# Altium schematic sheet CC_pwr-moteur.SchDoc
size A4; Author: Audran; CompanyName: Goldorak; Address1: Electrolab; Address2: 52 rue Paul Lescop; Address3: 92000 Nanterre; ProjectName: Cartes_2017
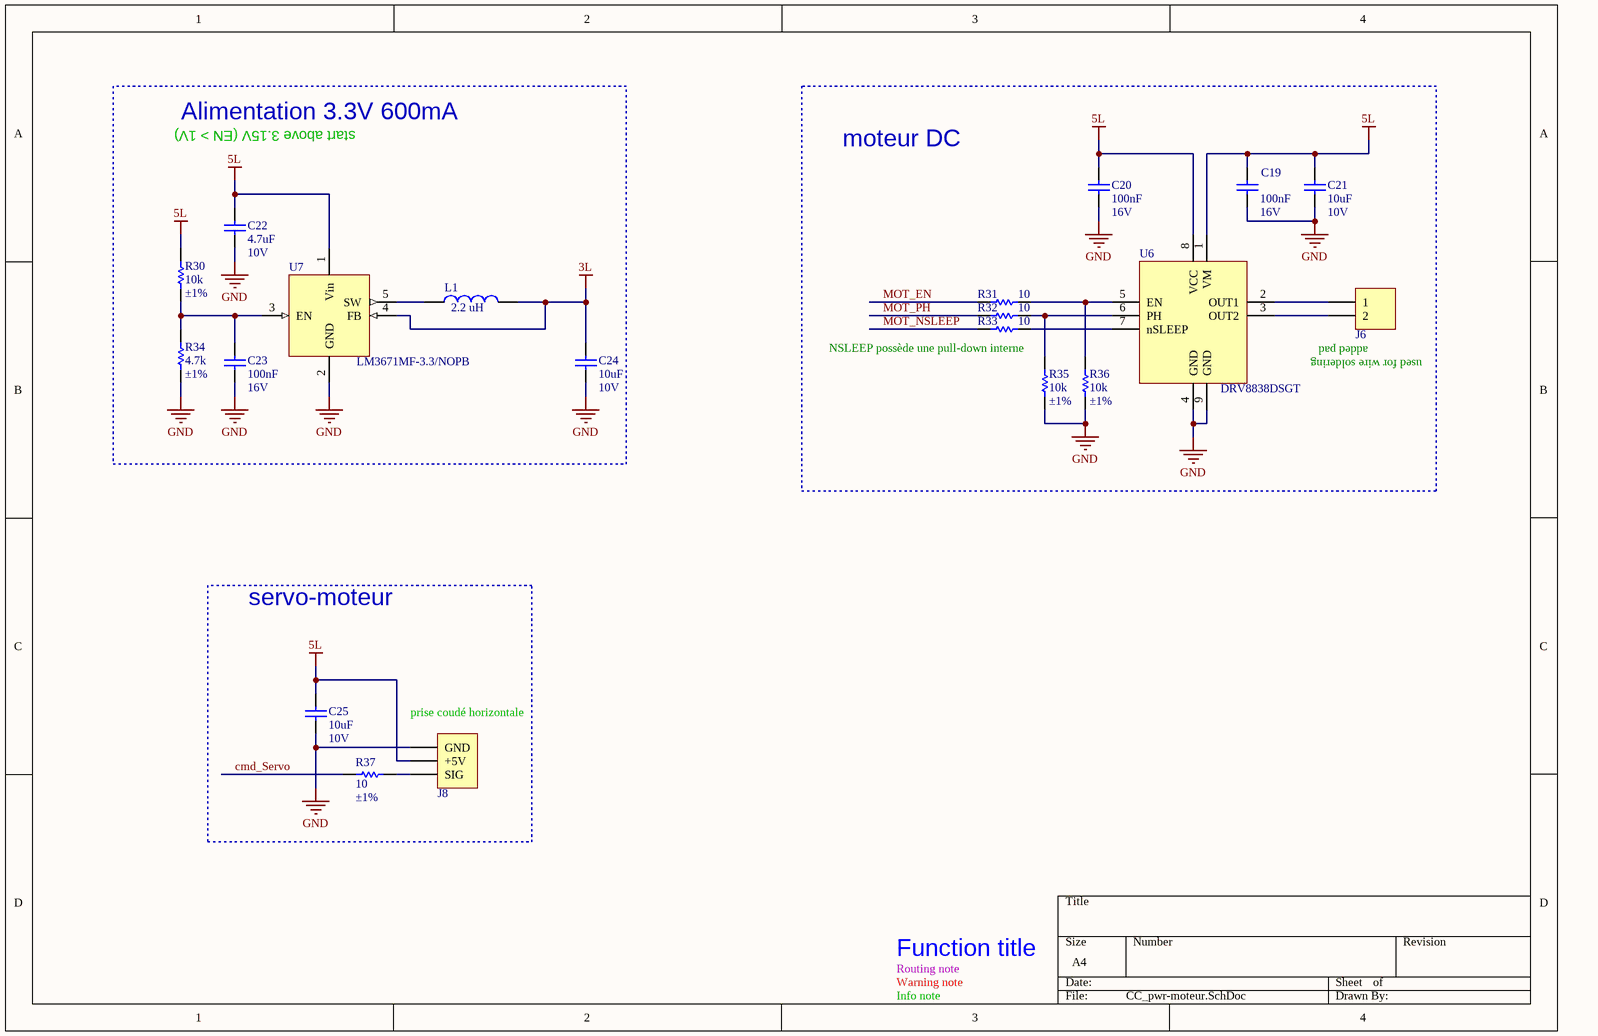
[diagram p0: CC_pwr-moteur.SchDoc]

## Parts
C19  100nF  RatedVoltage: 16V  [WCAP-CSGP_0402, 1x0.5x0.5]
C20  100nF  RatedVoltage: 16V  [WCAP-CSGP_0402, 1x0.5x0.5]
C21  10uF  RatedVoltage: 10V  [WCAP-CSGP_0805, 2x1.25x1.25]
C22  4.7uF  RatedVoltage: 10V  [WCAP-CSGP_0603, 1.6x0.8x0.8]
C23  100nF  RatedVoltage: 16V  [WCAP-CSGP_0402, 1x0.5x0.5]
C24  10uF  RatedVoltage: 10V  [WCAP-CSGP_0805, 2x1.25x1.25]
C25  10uF  RatedVoltage: 10V  [WCAP-CSGP_0805, 2x1.25x1.25]
J6  653102131822  [653102131822]  (value not drawn)
J8  61300311021  [61300311021]  (value not drawn)
L1  value 2.2 uH  [WE-LQS_2010]  (hidden comment: 74404020022)
R30  value 10k  Precision: ±1%  [RESC1005X04N]  (hidden comment: RC0402FR-0710KL)
R31  value 10  [RESC1005X04N]  (hidden comment: RC0402FR-0710RL)
R32  value 10  [RESC1005X04N]  (hidden comment: RC0402FR-0710RL)
R33  value 10  [RESC1005X04N]  (hidden comment: RC0402FR-0710RL)
R34  value 4.7k  Precision: ±1%  [RESC1005X04N]
R35  value 10k  Precision: ±1%  [RESC1005X04N]  (hidden comment: RC0402FR-0710KL)
R36  value 10k  Precision: ±1%  [RESC1005X04N]  (hidden comment: RC0402FR-0710KL)
R37  value 10  Precision: ±1%  [RESC1005X04N]  (hidden comment: RC0402FR-0710RL)
U6  DRV8838DSGT  [PSON50P200X80_HS-9N]
U7  LM3671MF-3.3/NOPB  [SOT23-5]

## Blocks framed on the sheet
Alimentation 3.3V 600mA: C22-C24 L1 R30 R34 U7
moteur DC: C19-C21 J6 R31-R33 R35 R36 U6
servo-moteur: C25 J8 R37

## Nets
3L: C24.2 L1.2 U7.4(FB)
5L: C19.2 C20.2 C21.2 C22.2 C25.2 J8.2(+5V) R30.2 U6.1(VM) U6.8(VCC) U7.1(Vin)
GND: C19.1 C20.1 C21.1 C22.1 C23.1 C24.1 C25.1 J8.1(GND) R34.1 R35.1 R36.1 U6.4(GND) U6.9(GND) U7.2(GND)
cmd_Servo: R37.1
MOT_EN: R31.1
MOT_NSLEEP: R33.1
MOT_PH: R32.1
NetC23_2: C23.2 R30.1 R34.2 U7.3(EN)
NetJ6_1: J6.1 U6.2(OUT1)
NetJ6_2: J6.2 U6.3(OUT2)
NetJ8_3: J8.3(SIG) R37.2
NetL1_1: L1.1 U7.5(SW)
NetR31_2: R31.2 R36.2 U6.5(EN)
NetR32_2: R32.2 R35.2 U6.6(PH)
NetR33_2: R33.2 U6.7(nSLEEP)

## Notes on the sheet
- start above 3.15V (EN > 1V)
- NSLEEP possède une pull-down interne
- (near J6) added pad
- used for wire soldering
- (near J8) prise coudé horizontale
- Routing note
- Warning note
- Function title
- Info note

## Library data of the parts
C19 C20 C23 = WCAP-CSGP, 885012205037: CAP CER 100nF 16V X7R 0402; Manufacturer: Wurth Elektronik; PublishedDate: Aug 2016; ComponentLink1Description: Manufacturer; ComponentLink1URL: http://www.we-online.de; ComponentLink2Description: Datasheet; ComponentLink2URL: http://katalog.we-online.com/pbs/datasheet/885012205037.pdf; Manufacturer Part Number: 885012205037; Value: 100nF; Size: 0402; CeramicType: X7R
C21 C24 C25 = WCAP-CSGP, 885012207026: CAP CER 10uF 10V X7R 0805; Manufacturer: Wurth Elektronik; PublishedDate: Aug 2016; ComponentLink1Description: Manufacturer; ComponentLink1URL: http://www.we-online.de; ComponentLink2Description: Datasheet; ComponentLink2URL: http://katalog.we-online.com/pbs/datasheet/885012207026.pdf; Manufacturer Part Number: 885012207026; Value: 10uF; Size: 0805; CeramicType: X7R
C22 = WCAP-CSGP, 885012106012: CAP CER 4.7UF 10V X5R 0603; Manufacturer: Wurth Elektronik; PublishedDate: Aug 2016; ComponentLink1Description: Manufacturer; ComponentLink1URL: http://www.we-online.de; ComponentLink2Description: Datasheet; ComponentLink2URL: http://katalog.we-online.com/pbs/datasheet/885012106012.pdf; Manufacturer Part Number: 885012106012; Value: 4.7uF; Size: 0603; CeramicType: X5R
J6 = 653102131822: WR-WTB 2 horiz. 1.25mm; Manufacturer: Wurth Electronics Inc.; Value: 2; ComponentLink1URL: http://www.we-online.com; ComponentLink2URL: http://katalog.we-online.de/em/datasheet/6531xx131822.pdf; Manufacturer Part Number: 653102131822; Supplier 1: farnell; Supplier Part Number 1: 1841413; ComponentLink1Description: Manufacturer; ComponentLink2Description: Datasheet
J8 = 61300311021: CONN HEADER 3p horiz. 2.54mm; Manufacturer: Wurth Electronics Inc.; Value: 3; Supplier 1: Farnell; Supplier Part Number 1: 2356177; Manufacturer Part Number: 61300311021; ComponentLink1URL: http://www.we-online.com; ComponentLink1Description: Manufacturer; ComponentLink2Description: Datasheet; ComponentLink2URL: http://katalog.we-online.de/em/datasheet/6130xx11021.pdf
L1 = 74404020022: FIXED IND 2.2UH 960MA 220 MOHM; Manufacturer: Wurth Elektronik; RatedCurrent: 0.96 A; PublishedDate: Nov. 2016; ComponentLink1Description: Manufacturer; ComponentLink1URL: http://www.we-online.de; ComponentLink2Description: Datasheet; ComponentLink2URL: http://katalog.we-online.de/pbs/datasheet/74404020022.pdf; Manufacturer Part Number: 74404020022; Size: 2010
R30 R35 R36 = RC0402FR-0710KL: RES SMD 10K OHM 1% 1/16W 0402; Manufacturer: Yageo; Power: 63mW; Vmax: 50V; Type: Thick Film; ComponentLink1Description: Manufacturer; ComponentLink1URL: http://www.yageo.com/NewPortal/_en/index.jsp; ComponentLink2Description: Datasheet; ComponentLink2URL: http://www.farnell.com/datasheets/2167052.pdf; Supplier 1: Farnell; Supplier Part Number 1: 9239359; Manufacturer Part Number: RC0402FR-0710KL
R31-R33 R37 = RC0402FR-0710RL: RES SMD 10 OHM 1% 1/16W 0402; Manufacturer: Yageo; Power: 63mW; Vmax: 50V; Type: Thick Film; ComponentLink1Description: Manufacturer; ComponentLink1URL: http://www.yageo.com/NewPortal/_en/index.jsp; ComponentLink2Description: Datasheet; ComponentLink2URL: http://www.farnell.com/datasheets/1018594.pdf; Manufacturer Part Number: RC0402FR-0710RL; Supplier 1: Farnell; Supplier Part Number 1: 9238999
  R31-R33: Precision: ±1%
R34 = RC0402FR-074K7L: RES SMD 4K7 OHM 1% 1/16W 0402; Manufacturer: Yageo; Power: 63mW; Vmax: 50V; Type: Thick Film; ComponentLink1Description: Manufacturer; ComponentLink1URL: http://www.yageo.com/NewPortal/_en/index.jsp; ComponentLink2Description: Datasheet; ComponentLink2URL: http://www.farnell.com/datasheets/2167052.pdf; Manufacturer Part Number: RC0402FR-074K7L; Supplier 1: Farnell; Supplier Part Number 1: 9239316
U6 = DRV8838DSGT: IC BRIDGE DRIVER PAR 8WSON; Manufacturer: Texas Instruments; Supplier 1: Farnell; Manufacturer Part Number: DRV8838DSGT; ComponentLink1URL: http://www.ti.com/lit/ds/symlink/drv8838.pdf; ComponentLink1Description: Datasheet; Supplier Part Number 1: 2420232
U7 = LM3671MF-3.3/NOPB: IC REG BUCK 3.3V 0.6A SYNC SOT23; Manufacturer: Texas Instruments; Supplier 1: Farnell; Supplier Part Number 1: 1685767; Manufacturer Part Number: LM3671MF-3.3/NOPB; ComponentLink1URL: http://www.ti.com/lit/ds/symlink/lm3671.pdf; ComponentLink1Description: Datasheet